# Altium schematic sheet AD9288.SchDoc
size A4
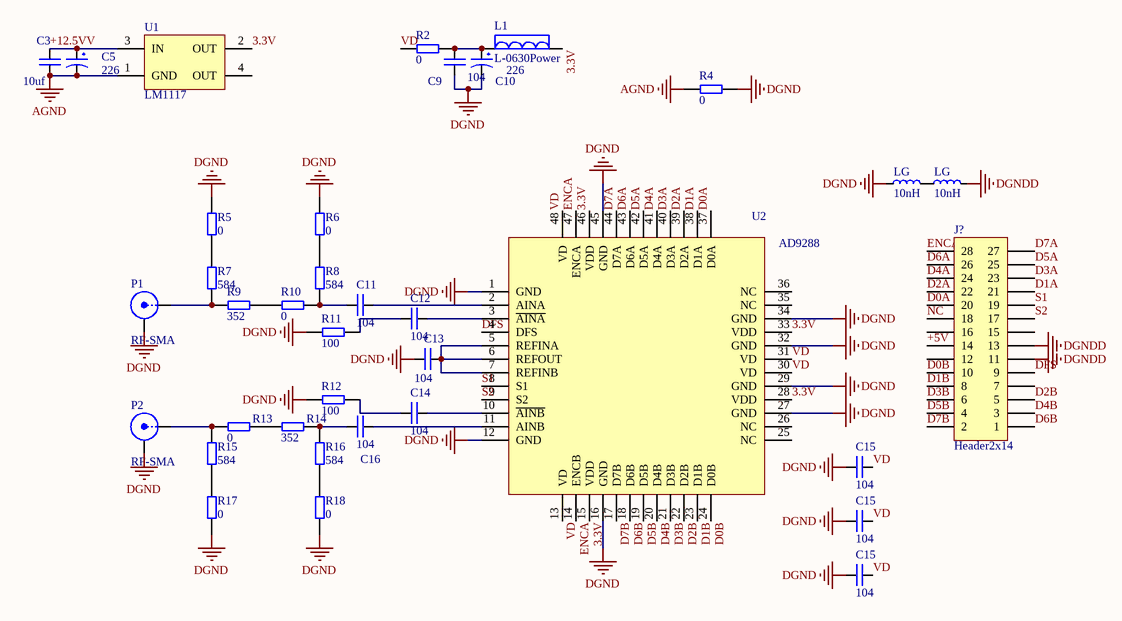
[diagram p0: AD9288.SchDoc]

## Parts
(Parts that share a designator on the sheet are numbered #1, #2 ... from top to bottom, then left to right.)
C3  10uf  [0805-CAP]
C5  226  [CAP_3216_A[1206]]
C9  104  [0805-CAP]
C10  226  [CAP_3216_A[1206]]
C11  104  [0805-CAP]
C12  104  [0805-CAP]
C13  104  [0805-CAP]
C14  104  [0805-CAP]
C15#1  104  [0805-CAP]
C15#2  104  [0805-CAP]
C15#3  104  [0805-CAP]
C16  104  [0805-CAP]
J?  Header2x14  [HEADER2X14]
L1  L-0630Power  [IND-PWR-0630]
LG#1  10nH  [0805-IND]
LG#2  10nH  [0805-IND]
P1  RF-SMA  [RFCON_SMA-EDGE]
P2  RF-SMA  [RFCON_SMA-EDGE]
R2  0  [0805-RES]
R4  0  [0805-RES]
R5  0  [0805-RES]
R6  0  [0805-RES]
R7  584  [0805-RES]
R8  584  [0805-RES]
R9  352  [0805-RES]
R10  0  [0805-RES]
R11  100  [0805-RES]
R12  100  [0805-RES]
R13  0  [0805-RES]
R14  352  [0805-RES]
R15  584  [0805-RES]
R16  584  [0805-RES]
R17  0  [0805-RES]
R18  0  [0805-RES]
U1  LM1117  [SOT-223]
U2  AD9288  [LQFP-48]

## Nets
AGND: C3.1 C5.2 R4.1 U1.1(GND)
DGND: C9.1 C10.2 C13.1 C15#1.2 C15#2.2 C15#3.2 LG#1.1 P1.2(Y) P2.2(Y) R4.2 R5.1 R6.1 R11.1 R12.1 R17.1 R18.1 U2.1(GND) U2.12(GND) U2.16(GND) U2.27(GND) U2.29(GND) U2.32(GND) U2.34(GND) U2.45(GND)
DGNDD: J?.11 J?.13 LG#2.2
3.3V: L1.2 U1.2(OUT) U2.15(VDD) U2.28(VDD) U2.33(VDD) U2.46(VDD)
+5V: J?.14
+12.5VV: C3.2 C5.1 U1.3(IN)
D0A: J?.20 U2.37(D0A)
D0B: J?.10 U2.24(D0B)
D1A: J?.21 U2.38(D1A)
D1B: J?.8 U2.23(D1B)
D2A: J?.22 U2.39(D2A)
D2B: J?.5 U2.22(D2B)
D3A: J?.23 U2.40(D3A)
D3B: J?.6 U2.21(D3B)
D4A: J?.24 U2.41(D4A)
D4B: J?.3 U2.20(D4B)
D5A: J?.25 U2.42(D5A)
D5B: J?.4 U2.19(D5B)
D6A: J?.26 U2.43(D6A)
D6B: J?.1 U2.18(D6B)
D7A: J?.27 U2.44(D7A)
D7B: J?.2 U2.17(D7B)
DFS: J?.9 U2.4(DFS)
ENCA: J?.28 U2.14(ENCB) U2.47(ENCA)
NC: J?.18
S1: J?.19 U2.8(S1)
S2: J?.17 U2.9(S2)
VD: C15#1.1 C15#2.1 C15#3.1 R2.1 U2.13(VD) U2.30(VD) U2.31(VD) U2.48(VD)
NetC9_2: C9.2 C10.1 L1.1 R2.2
NetC11_1: C11.1 R8.2 R10.2
NetC11_2: C11.2 U2.2(AINA)
NetC12_1: C12.1 R11.2
NetC12_2: C12.2 U2.3(~{AINA})
NetC13_2: C13.2 U2.5(REFINA) U2.6(REFOUT) U2.7(REFINB)
NetC14_1: C14.1 R12.2
NetC14_2: C14.2 U2.10(~{AINB})
NetC16_1: C16.1 R14.1 R16.2
NetC16_2: C16.2 U2.11(AINB)
NetLG#1_2: LG#1.2 LG#2.1
NetP1_1: P1.1(X) R7.2 R9.1
NetP2_1: P2.1(X) R13.2 R15.2
NetR5_2: R5.2 R7.1
NetR6_2: R6.2 R8.1
NetR9_2: R9.2 R10.1
NetR13_1: R13.1 R14.2
NetR15_1: R15.1 R17.2
NetR16_1: R16.1 R18.2

Not connected (* = marked no-connect by the designer): J? 7 12 15 16; U1 4(OUT); U2 25(NC) 26(NC) 35(NC) 36(NC)

## Library data of the parts
C3 C9 C11-C14 C15#1-C15#3 C16 = C0805
C5 C10 = C-Tan: Tantalum Cap
L1 = L-PWR-0630: 一体成型电感
LG#1 LG#2 = L0805
R2 R4-R18 = R0805: 0805贴片电阻
U1 = LM1117_SOT_223